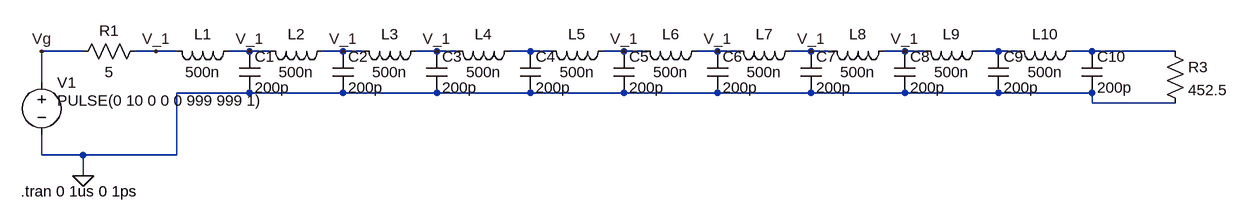
[diagram p0: schematic 2b20.asc]
2b20.asc, the LTspice schematic file:
Version 4.1
SHEET 1 1832 680
WIRE 64 96 0 96
WIRE 176 96 144 96
WIRE 208 96 176 96
WIRE 320 96 288 96
WIRE 352 96 320 96
WIRE 464 96 432 96
WIRE 496 96 464 96
WIRE 608 96 576 96
WIRE 640 96 608 96
WIRE 752 96 720 96
WIRE 784 96 752 96
WIRE 896 96 864 96
WIRE 928 96 896 96
WIRE 1040 96 1008 96
WIRE 1072 96 1040 96
WIRE 1184 96 1152 96
WIRE 1216 96 1184 96
WIRE 1328 96 1296 96
WIRE 1360 96 1328 96
WIRE 1472 96 1440 96
WIRE 1504 96 1472 96
WIRE 1616 96 1584 96
WIRE 1744 96 1616 96
WIRE 0 144 0 96
WIRE 320 160 208 160
WIRE 464 160 320 160
WIRE 608 160 464 160
WIRE 752 160 608 160
WIRE 896 160 752 160
WIRE 1040 160 896 160
WIRE 1184 160 1040 160
WIRE 1328 160 1184 160
WIRE 1472 160 1328 160
WIRE 1616 160 1472 160
WIRE 1616 176 1616 160
WIRE 1744 176 1616 176
WIRE 0 256 0 224
WIRE 64 256 0 256
WIRE 208 256 208 160
WIRE 208 256 64 256
WIRE 64 288 64 256
FLAG 64 288 0
FLAG 0 96 Vg
FLAG 176 96 V_1
FLAG 320 96 V_1
FLAG 464 96 V_1
FLAG 608 96 V_1
FLAG 896 96 V_1
FLAG 1040 96 V_1
FLAG 1184 96 V_1
FLAG 1328 96 V_1
SYMBOL voltage 0 128 R0
WINDOW 3 24 44 Left 2
WINDOW 123 0 0 Left 0
WINDOW 39 0 0 Left 0
SYMATTR Value PULSE(0 10 0 0 0 999 999 1)
SYMATTR InstName V1
SYMBOL res 48 112 R270
WINDOW 0 32 56 VTop 2
WINDOW 3 0 56 VBottom 2
SYMATTR InstName R1
SYMATTR Value 5
SYMBOL ind 304 80 R90
WINDOW 0 5 56 VBottom 2
WINDOW 3 32 56 VTop 2
SYMATTR InstName L1
SYMATTR Value 500n
SYMBOL cap 304 96 R0
SYMATTR InstName C1
SYMATTR Value 200p
SYMBOL ind 448 80 R90
WINDOW 0 5 56 VBottom 2
WINDOW 3 32 56 VTop 2
SYMATTR InstName L2
SYMATTR Value 500n
SYMBOL cap 448 96 R0
SYMATTR InstName C2
SYMATTR Value 200p
SYMBOL ind 592 80 R90
WINDOW 0 5 56 VBottom 2
WINDOW 3 32 56 VTop 2
SYMATTR InstName L3
SYMATTR Value 500n
SYMBOL cap 592 96 R0
SYMATTR InstName C3
SYMATTR Value 200p
SYMBOL ind 736 80 R90
WINDOW 0 5 56 VBottom 2
WINDOW 3 32 56 VTop 2
SYMATTR InstName L4
SYMATTR Value 500n
SYMBOL cap 736 96 R0
SYMATTR InstName C4
SYMATTR Value 200p
SYMBOL ind 880 80 R90
WINDOW 0 5 56 VBottom 2
WINDOW 3 32 56 VTop 2
SYMATTR InstName L5
SYMATTR Value 500n
SYMBOL cap 880 96 R0
SYMATTR InstName C5
SYMATTR Value 200p
SYMBOL ind 1024 80 R90
WINDOW 0 5 56 VBottom 2
WINDOW 3 32 56 VTop 2
SYMATTR InstName L6
SYMATTR Value 500n
SYMBOL cap 1024 96 R0
SYMATTR InstName C6
SYMATTR Value 200p
SYMBOL ind 1168 80 R90
WINDOW 0 5 56 VBottom 2
WINDOW 3 32 56 VTop 2
SYMATTR InstName L7
SYMATTR Value 500n
SYMBOL cap 1168 96 R0
SYMATTR InstName C7
SYMATTR Value 200p
SYMBOL ind 1312 80 R90
WINDOW 0 5 56 VBottom 2
WINDOW 3 32 56 VTop 2
SYMATTR InstName L8
SYMATTR Value 500n
SYMBOL cap 1312 96 R0
SYMATTR InstName C8
SYMATTR Value 200p
SYMBOL ind 1456 80 R90
WINDOW 0 5 56 VBottom 2
WINDOW 3 32 56 VTop 2
SYMATTR InstName L9
SYMATTR Value 500n
SYMBOL cap 1456 96 R0
SYMATTR InstName C9
SYMATTR Value 200p
SYMBOL ind 1600 80 R90
WINDOW 0 5 56 VBottom 2
WINDOW 3 32 56 VTop 2
SYMATTR InstName L10
SYMATTR Value 500n
SYMBOL cap 1600 96 R0
SYMATTR InstName C10
SYMATTR Value 200p
SYMBOL res 1728 80 R0
SYMATTR InstName R3
SYMATTR Value 452.5
TEXT -32 312 Left 2 !.tran 0 1us 0 1ps

The netlist it stands for:
* 2b20.asc
V1 Vg 0 PULSE(0 10 0 0 0 999 999 1)
R1 Vg V_1 5
L1 V_1 V_1 500n
C1 V_1 0 200p
L2 V_1 V_1 500n
C2 V_1 0 200p
L3 V_1 V_1 500n
C3 V_1 0 200p
L4 N001 V_1 500n
C4 N001 0 200p
L5 V_1 N001 500n
C5 V_1 0 200p
L6 V_1 V_1 500n
C6 V_1 0 200p
L7 V_1 V_1 500n
C7 V_1 0 200p
L8 V_1 V_1 500n
C8 V_1 0 200p
L9 N002 V_1 500n
C9 N002 0 200p
L10 N003 N002 500n
C10 N003 0 200p
R3 N003 0 452.5
.tran 0 1us 0 1ps
.backanno
.end